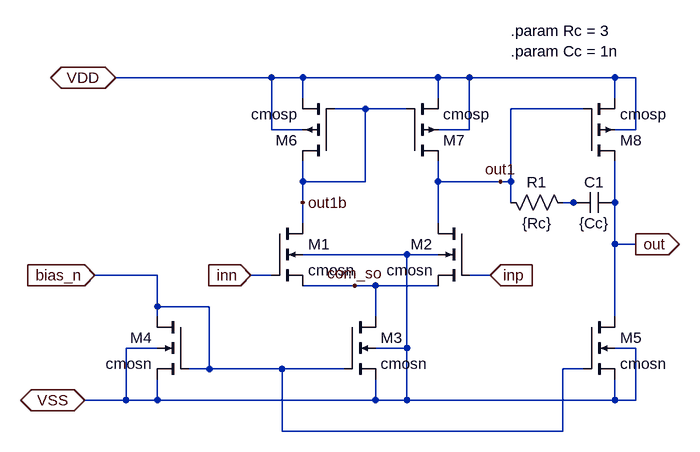
[diagram p0: schematic OTA_twoStage_N.asc]
OTA_twoStage_N.asc, the LTspice schematic file:
Version 4
SHEET 1 932 680
WIRE 288 16 48 16
WIRE 336 16 288 16
WIRE 544 16 336 16
WIRE 592 16 544 16
WIRE 816 16 592 16
WIRE 848 16 816 16
WIRE 336 48 336 16
WIRE 544 48 544 16
WIRE 816 48 816 16
WIRE 432 64 384 64
WIRE 496 64 432 64
WIRE 768 64 656 64
WIRE 288 96 288 16
WIRE 336 96 288 96
WIRE 592 96 592 16
WIRE 592 96 544 96
WIRE 848 96 848 16
WIRE 848 96 816 96
WIRE 336 176 336 144
WIRE 432 176 432 64
WIRE 432 176 336 176
WIRE 544 176 544 144
WIRE 640 176 544 176
WIRE 656 176 656 64
WIRE 656 176 640 176
WIRE 336 208 336 176
WIRE 656 208 656 176
WIRE 752 208 736 208
WIRE 768 208 752 208
WIRE 816 208 816 144
WIRE 336 240 336 208
WIRE 544 240 544 176
WIRE 816 272 816 208
WIRE 848 272 816 272
WIRE 496 288 336 288
WIRE 544 288 496 288
WIRE 112 320 16 320
WIRE 288 320 256 320
WIRE 624 320 592 320
WIRE 416 336 336 336
WIRE 448 336 416 336
WIRE 544 336 448 336
WIRE 112 368 112 320
WIRE 192 368 112 368
WIRE 112 384 112 368
WIRE 448 384 448 336
WIRE 816 384 816 272
WIRE 112 432 64 432
WIRE 496 432 496 288
WIRE 496 432 448 432
WIRE 848 432 816 432
WIRE 192 464 192 368
WIRE 192 464 160 464
WIRE 304 464 192 464
WIRE 400 464 304 464
WIRE 768 464 736 464
WIRE 64 512 64 432
WIRE 64 512 0 512
WIRE 112 512 112 480
WIRE 112 512 64 512
WIRE 448 512 448 480
WIRE 448 512 112 512
WIRE 496 512 496 432
WIRE 496 512 448 512
WIRE 816 512 816 480
WIRE 816 512 496 512
WIRE 848 512 848 432
WIRE 848 512 816 512
WIRE 304 560 304 464
WIRE 736 560 736 464
WIRE 736 560 304 560
FLAG 256 320 inn
IOPIN 256 320 In
FLAG 624 320 inp
IOPIN 624 320 In
FLAG 848 272 out
IOPIN 848 272 Out
FLAG 48 16 VDD
IOPIN 48 16 BiDir
FLAG 0 512 VSS
IOPIN 0 512 BiDir
FLAG 16 320 bias_n
IOPIN 16 320 In
FLAG 416 336 com_so
FLAG 336 208 out1b
FLAG 640 176 out1
DATAFLAG 240 464 "$"
DATAFLAG 384 176 "$"
DATAFLAG 400 336 "$"
DATAFLAG 816 320 "$"
DATAFLAG 608 512 "$"
DATAFLAG 176 16 "$"
DATAFLAG 576 176 "$"
SYMBOL nmos4 288 240 R0
SYMATTR InstName M1
SYMATTR Value cmosn
SYMATTR Value2 l=500n w=4u ad=1p as=1p pd=4.5u ps=4.5u m=16
SYMBOL nmos4 592 240 M0
SYMATTR InstName M2
SYMATTR Value cmosn
SYMATTR Value2 l=500n w=4u ad=1p as=1p pd=4.5u ps=4.5u m=16
SYMBOL nmos4 400 384 R0
SYMATTR InstName M3
SYMATTR Value cmosn
SYMATTR Value2 l=500n w=4u ad=1p as=1p pd=4.5u ps=4.5u m=32
SYMBOL nmos4 160 384 M0
SYMATTR InstName M4
SYMATTR Value cmosn
SYMATTR Value2 l=500n w=4u ad=1p as=1p pd=4.5u ps=4.5u m=16
SYMBOL nmos4 768 384 R0
SYMATTR InstName M5
SYMATTR Value cmosn
SYMATTR Value2 l=500n w=4u ad=1p as=1p pd=4.5u ps=4.5u m=64
SYMBOL pmos4 384 144 R180
SYMATTR InstName M6
SYMATTR Value cmosp
SYMATTR Value2 l=0.5u w=4u ad=1p as=1p pd=4.5u ps=4.5u m=48
SYMBOL pmos4 496 144 M180
SYMATTR InstName M7
SYMATTR Value cmosp
SYMATTR Value2 l=0.5u w=4u ad=1p as=1p pd=4.5u ps=4.5u m=48
SYMBOL pmos4 768 144 M180
SYMATTR InstName M8
SYMATTR Value cmosp
SYMATTR Value2 l=0.5u w=4u ad=1p as=1p pd=4.5u ps=4.5u m=192
SYMBOL cap 816 192 R90
WINDOW 0 0 32 VBottom 2
WINDOW 3 32 32 VTop 2
SYMATTR InstName C1
SYMATTR Value {Cc}
SYMBOL res 752 224 M270
WINDOW 0 32 56 VTop 2
WINDOW 3 0 56 VBottom 2
SYMATTR InstName R1
SYMATTR Value {Rc}
TEXT 656 -56 Left 2 !.param Rc = 3\n.param Cc = 1n

The netlist it stands for:
* OTA_twoStage_N.asc
M1 out1b inn com_so VSS cmosn l=500n w=4u ad=1p as=1p pd=4.5u ps=4.5u m=16
M2 out1 inp com_so VSS cmosn l=500n w=4u ad=1p as=1p pd=4.5u ps=4.5u m=16
M3 com_so bias_n VSS VSS cmosn l=500n w=4u ad=1p as=1p pd=4.5u ps=4.5u m=32
M4 bias_n bias_n VSS VSS cmosn l=500n w=4u ad=1p as=1p pd=4.5u ps=4.5u m=16
M5 out bias_n VSS VSS cmosn l=500n w=4u ad=1p as=1p pd=4.5u ps=4.5u m=64
M6 out1b out1b VDD VDD cmosp l=0.5u w=4u ad=1p as=1p pd=4.5u ps=4.5u m=48
M7 out1 out1b VDD VDD cmosp l=0.5u w=4u ad=1p as=1p pd=4.5u ps=4.5u m=48
M8 out out1 VDD VDD cmosp l=0.5u w=4u ad=1p as=1p pd=4.5u ps=4.5u m=192
C1 out N001 {Cc}
R1 N001 out1 {Rc}
.model NMOS NMOS
.model PMOS PMOS
.lib standard.mos
.param Rc = 3
.param Cc = 1n
.backanno
.end